# Altium schematic sheet 20-Power-P1V8.SchDoc
size B; SheetNumber: 20; SheetTotal: 22; SPICEModelCachePRDMSQGY: <root> / <DocumentId>PRDMSQGY</DocumentId> / <CacheFrame Number="0"> / <Model Name="emk105bj105_v-f" Kind="CKT"> / <Text>* EMK105BJ105_V-F     SPICE MODEL  ( General Type ) / *-------------------------------------------------------------------------------------------------------- / * Model Generated by TAIYO YUDEN Corporation (http://www.ty-top.com) / * Version 1.0 / * TAIYO YUDEN Control No. 170508_130520 / * Copyright(c) 2012 TAIYO YUDEN CO.,LTD. All Rights Reserved. / *-------------------------------------------------------------------------------------------------------- / * / * Products Name : Multilayer Ceramic Capacitors / * / * Characteristics : / *     Capacitance : 1 uF , Rated Voltage : 16V , TCC : X5R / *     Case Size : 1.0 x 0.5 / 0.039 x 0.02 [mm/inch] , Thickness : 0.5 / 0.02 [mm/inch] / *     (Conditions: Temperature = 25 degC , DC Bias Current/Voltage = 0A / 0V) / * / * Frequency Range : 40Hz - 3GHz / * / * External Node Assignments : / * / *  1  o---| |---o  2 / * / *-------------------------------------------------------------------------------------------------------- / .SubCkt EMK105BJ105_V-F 1 2 / **************************** / C0 1 110 0.68309u / Cm 1 101 0.26053u / C1 101 102 0.94076u / Rc1 101 102 1.9029k / C2 102 103 0.66707u / Rc2 102 103 120.36 / C3 103 110 0.57203u / Rc3 103 110 2.1097 / C2m 1 301 0.1871u / C21 301 302 3.2494u / Rc21 301 302 1.1117k / C22 302 303 2.1014u / Rc22 302 303 1.484k / C23 303 304 2.1172u / Rc23 303 304 1.3876k / C24 304 305 0.75729u / Rc24 304 305 332.59 / C25 305 306 0.94401u / Rc25 305 306 249.09 / C26 306 307 0.34674u / Rc26 306 307 28.352 / C27 307 308 0.37158u / Rc27 307 308 19.989 / C28 308 309 0.17933u / Rc28 308 309 31.748 / C29 309 110 0.016445u / Rc29 309 110 1.0592 / Rp0 1 110 100Meg / L0 110 120 0.2216n / Lm 120 130 0.1509n / L1 120 121 0.12659n / RL1 121 130 0.85161 / L2 120 122 0.15996n / RL2 122 130 0.42469 / L3 120 123 7.9543n / RL3 123 130 0.54643m / CR 120 124 0.24334u / LR 124 125 0.090738n / RR 125 130 68.076m / CL 130 140 2.7354p / LL 130 140 0.10762n / RL 130 140 50.614 / Rs 140 2 7.5416m / **************************** / .ends EMK105BJ105_V-F</Text> / </Model> / </CacheFrame> / </root>
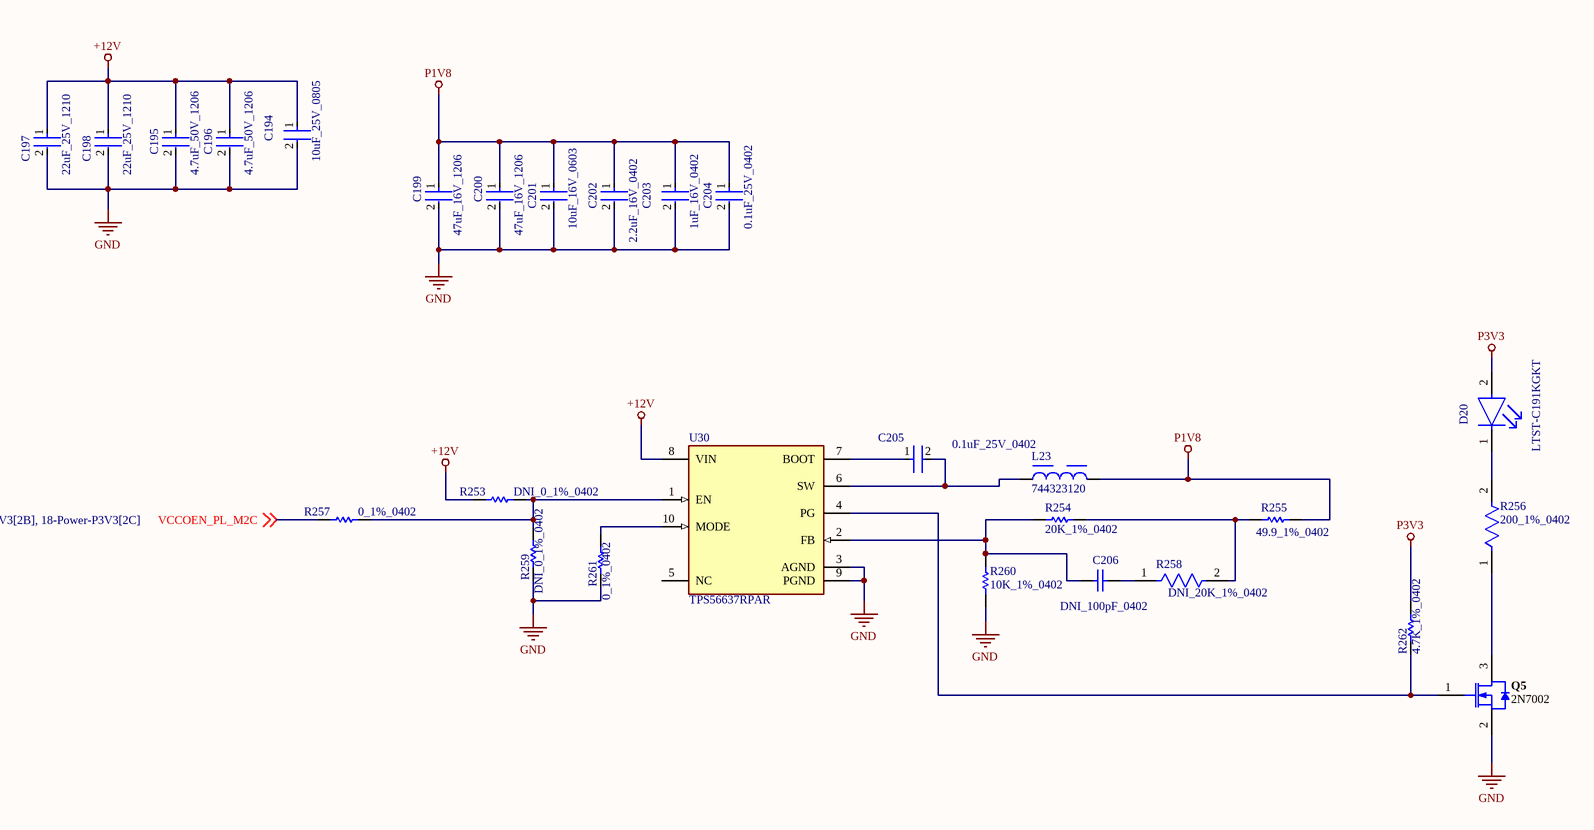
[diagram p0: 20-Power-P1V8.SchDoc]

## Parts
C194  10uF_25V_0805  [FP-0805-L_2_0_0_2-W_1_25-MFG]
C195  4.7uF_50V_1206  [FP-GRM31C-0_2-e0_3_0_8-IPC_C]
C196  4.7uF_50V_1206  [FP-GRM31C-0_2-e0_3_0_8-IPC_C]
C197  22uF_25V_1210  [FP-MK325M-MFG]
C198  22uF_25V_1210  [FP-MK325M-MFG]
C199  47uF_16V_1206  [FP-C3216-160-0_2-MFG]
C200  47uF_16V_1206  [FP-C3216-160-0_2-MFG]
C201  10uF_16V_0603  [FP-0603-L_1_6_0_2-W_0_8_0-MFG]
C202  2.2uF_16V_0402  [FP-C1005-050-0_05-IPC_A]
C203  1uF_16V_0402  [FP-0402-L_1_0_0_05-W_0_5-IPC_A]
C204  0.1uF_25V_0402  [FP-0402-L_1_0_1-W_0_5_0_1-IPC_C]
C205  0.1uF_25V_0402  [FP-0402-L_1_0_1-W_0_5_0_1-IPC_C]
C206  DNI_100pF_0402  [CAPC1005X55X25ML05T10]  (no BOM)
D20  LTST-C191KGKT  [FP-LTST-C191KGKT-MFG]
L23  744323120  [WE-HCI_1030]
Q5  2N7002  [INF-PG-SOT23_M]
R253  DNI_0_1%_0402  [RESC1005X40X25LL05T05]  (no BOM)
R254  20K_1%_0402  [RESC1005X40X25NL10T10]
R255  49.9_1%_0402  [RESC1005X40X25LL05T10]
R256  200_1%_0402  [FP-ERJ2RK-IPC_A]
R257  0_1%_0402  [RESC1005X40X25LL05T05]
R258  DNI_20K_1%_0402  [FP-ERJ2RK-MFG]  (no BOM)
R259  DNI_0_1%_0402  [RESC1005X40X25LL05T05]  (no BOM)
R260  10K_1%_0402  [RESC1005X40X25LL05T05]
R261  0_1%_0402  [RESC1005X40X25LL05T05]
R262  4.7K_1%_0402  [RESC1005X40X25NL10T10]
U30  TPS56637RPAR  [FP-RPA0010A-MFG]

## Nets
+12V: C194.1 C195.1 C196.1 C197.1 C198.1 R253.1 U30.8(VIN)
GND: C194.2 C195.2 C196.2 C197.2 C198.2 C199.2 C200.2 C201.2 C202.2 C203.2 C204.2 Q5.2(SOURCE) R259.1 R260.1 R261.1 U30.3(AGND) U30.9(PGND)
P1V8: C199.1 C200.1 C201.1 C202.1 C203.1 C204.1 L23.2 R255.2
P3V3: D20.2(A) R262.2
VCCOEN_PL_M2C: R257.1 ; off-sheet VCCOEN_PL_M2C
NetC205_1: C205.1 U30.7(BOOT)
NetC205_2: C205.2 L23.1 U30.6(SW)
NetC206_1: C206.1 R254.1 R260.2 U30.2(FB)
NetC206_2: C206.2 R258.1
NetD20_1: D20.1(C) R256.2
NetQ5_1: Q5.1(GATE) R262.1 U30.4(PG)
NetQ5_3: Q5.3(DRAIN) R256.1
NetR253_2: R253.2 R257.2 R259.2 U30.1(EN)
NetR254_2: R254.2 R255.1 R258.2
NetR261_2: R261.2 U30.10(MODE)

Not connected (* = marked no-connect by the designer): U30 5(NC)

## Library data of the parts
C194 = CMP-14477-000079-3: Multilayer Ceramic Capacitor 10uF 25V X5R 10% SMD 0805 T/R; Voltage: 16V; Dielectric: X7R; Number of Pins: 2; Width: 0.049inch; REACH SVHC: No SVHC; Packaging: Tape and Reel; Max Operating Temperature: 85°C; Length: 0.079inch; Termination: SMD/SMT; RoHS Compliant: Yes; Thickness: 0.053inch; Case/Package: 0805; Case Code (Imperial): 0805; Capacitance: 10uF; Lead Free: Lead Free; Voltage Rating: 25V; Resistor Type: Ceramic; Voltage Rating (DC): 25V; Case Code (Metric): 2012; Mount: Surface Mount; Package Quantity: 1; Height: 1.25mm; Series: M; Tolerance: 10%; Min Operating Temperature: -55°C
C195 C196 = CMP-1037-04923-3: Chip Multilayer Ceramic Capacitors for General Purpose, 1206, 4.7uF, X7R, 15%, 10%, 50V; Height: 1.6mm; Voltage: 50V; Capacitance: 4.7uF; Lead Free: Lead Free; Max Operating Temperature: 125°C; Packaging: Tape and Reel; REACH SVHC: No SVHC; Voltage Rating: 50V; Mount: Surface Mount; Termination: SMD/SMT; Tolerance: 10%; Case/Package: 1206; Material: Ceramic; Depth: 1.6mm; Length: 3.2mm; Case Code (Metric): 3216; Voltage Rating (DC): 50V; Case Code (Imperial): 1206; Radiation Hardening: No; Width: 0.063inch; Thickness: 0.071inch; Package Quantity: 2000; Min Operating Temperature: -55°C; Dielectric: X7R
C197 C198 = CMP-14477-000145-1: CAP CER 22UF 25V X5R 1210; Tolerance: 20%; Width: 0.098inch; Thickness: 0.106inch; Depth: 2.5mm; Packaging: Tape and Reel; Max Operating Temperature: 85°C; Termination: SMD/SMT; Case Code (Imperial): 1210; Height: 2.5mm; Case/Package: 1210; Voltage Rating: 25V; Package Quantity: 1; Min Operating Temperature: -55°C; Capacitance: 22uF; Halogen Free: Halogen Free; Case Code (Metric): 3225; Mount: Surface Mount; Construction: Flat; Radiation Hardening: No; Length: 3.2mm; Voltage Rating (DC): 25V; Contact Plating: Nickel; Number of Pins: 2; Dielectric: X5R; RoHS Compliant: Yes; Resistor Type: Ceramic; Series: M
C199 C200 = CMP-2000-07442-2: Multilayer Ceramic Capacitors 47uF ±20% 16V X5R SMD 1206; Resistor Type: Ceramic; Width: 0.063inch; Case Code (Imperial): 1206; Radiation Hardening: No; Thickness: 0.071inch; Dielectric: X5R; Weight: 0.000571oz; Termination: SMD/SMT; Dielectric Material: Ceramic; Min Operating Temperature: -55°C; Depth: 1.6mm; Case Code (Metric): 3216; Max Operating Temperature: 85°C; RoHS Compliant: Yes; REACH SVHC: No SVHC; Mount: Surface Mount; Lead Free: Lead Free; Height: 1.6mm; Length: 3.2mm; Tolerance: 20%; Voltage Rating (DC): 16V; Capacitance: 47uF; Package Quantity: 1; Construction: Flat; Packaging: Tape and Reel; Series: C; Case/Package: 1206; Voltage Rating: 16V
C201 = CMP-2000-06226-4: Multilayer Ceramic Capacitor 10uF 16V X5R 20% SMD 0603 T/R; Packaging: Tape and Reel; Construction: Flat; Height: 0.8mm; Max Operating Temperature: 85°C; Dielectric: X5R; Case Code (Metric): 1608; Voltage Rating (DC): 16V; Width: 0.031inch; Voltage Rating: 16V; Length: 0.063inch; RoHS Compliant: Yes; Halogen Free: Halogen Free; Case Code (Imperial): 0603; Capacitance: 10uF; Mount: Surface Mount; Thickness: 0.031inch; Tolerance: 20%; Min Operating Temperature: -55°C; Series: M; Termination: SMD/SMT; Case/Package: 0603; Package Quantity: 1
C202 = CMP-2000-05998-2: Multilayer Ceramic Capacitors 2.2μF ±10% 16V X5R SMD 0402; Capacitance: 2.2uF; REACH SVHC: No SVHC; Series: C; Termination: SMD/SMT; Case Code (Imperial): 0402; Depth: 0.5mm; Mount: Surface Mount; Width: 0.02inch; Package Quantity: 1; Dielectric Material: Ceramic; Length: 1mm; Packaging: Tape and Reel; Case Code (Metric): 1005; RoHS Compliant: Yes; Dielectric: X5R; Max Operating Temperature: 85°C; Lead Free: Lead Free; Weight: 2.3E-05oz; Thickness: 0.022inch; Voltage Rating (DC): 16V; Tolerance: 10%; Voltage Rating: 16V; Resistor Type: Ceramic; Height: 0.5mm; Case/Package: 0402; Min Operating Temperature: -55°C
C203 = CMP-14477-000104-2: None; Tolerance: 10%; Voltage Rating: 16V; Dielectric: X5R; Capacitance: 1uF; Packaging: Tape and Reel; Depth: 0.5mm; Mount: Surface Mount; Thickness: 0.022inch; Package Quantity: 1; Min Operating Temperature: -55°C; Series: M; Voltage Rating (DC): 16V; Termination: SMD/SMT; Case/Package: 0402; Number of Pins: 2; Case Code (Imperial): 0402; Length: 1mm; Halogen Free: Halogen Free; Case Code (Metric): 1005; Width: 0.02inch; RoHS Compliant: Yes; Radiation Hardening: No; Max Operating Temperature: 85°C; Height: 0.5mm; Construction: Flat
C204 C205 = CMP-2008-02519-2: General Purpose Ceramic Capacitor, 0402, 100nF, 10%, X7R, 15%, 25V; Package Quantity: 1; Capacitance: 100nF; Min Operating Temperature: -55°C; Voltage: 25V; Voltage Rating: 25V; Construction: Flat; Max Operating Temperature: 125°C; Radiation Hardening: No; Depth: 0.5mm; Thickness: 0.022inch; Voltage Rating (DC): 25V; Number of Pins: 2; Lead Free: Lead Free; Series: -; REACH SVHC: No SVHC; Length: 1mm; Dielectric: X7R; RoHS Compliant: Yes; Mount: Surface Mount; Packaging: Tape and Reel; Case/Package: 0402; Case Code (Imperial): 0402; Termination: SMD/SMT; Width: 0.02inch; Case Code (Metric): 1005; Tolerance: 10%
C206 = CMP-2008-03915-1: Manufacturer: Murata; Part Number: GRM1555C1H101JA01D
D20 = CMP-2000-05198-2: LED GREEN CLEAR SMD; Max Power Dissipation: 75mW; Forward Current: 30mA; Reverse Voltage: 5V; Lens Color: Colorless; Forward Voltage: 2V; Dominant Wavelength: 571nm; Number of LEDs: 1; Viewing Angle: 130°; Lens Style: Rectangular; Test Current: 20mA; Luminous Intensity: 35mcd; Wavelength: 574nm; Width: 0.8mm; Case Code (Imperial): 0603; Number of Pins: 2; Lead Free: Lead Free; Packaging: Tape and Reel; Package Quantity: 1; Min Operating Temperature: -55°C; Case/Package: 0603; Length: 1.6mm; Power Dissipation: 75mW; Depth: 0.8mm; Radiation Hardening: No; Mount: Surface Mount; Max Operating Temperature: 85°C; Color: Green; Power Rating: 75mW; Height: 0.55mm; Illumination Color: Green; Case Code (Metric): 1608; Lens Transparency: Clear; Number of Elements: 1
L23 = CMP-0226-00168-2: NexarPartId: 23379116; Self Resonant Frequency: 59MHz; Max DC Current: 12A; DC Resistance (DCR): 6.6mΩ; Shielding: Shielded; Saturation Current: 15A; Inductance Tolerance: 20%; Inductance: 1.2µH; Series Resistance: 6.6Ω; Test Frequency: 100kHz; Termination: SMD/SMT; Length: 10.6mm; REACH SVHC: No SVHC; Case/Package: Nonstandard; Width: 10.6mm; Min Operating Temperature: -40°C; Composition: Wirewound; Ambient Temperature Range Low: -40°C; Number of Pins: 2; Current Rating: 12A; Depth: 10.6mm; Height - Seated (Max): 3.0988mm; Max Operating Temperature: 150°C; Ambient Temperature Range High: 100°C; Packaging: Tape & Reel (TR); Mount: Surface Mount; Height: 2.8mm; Tolerance: 20%; RoHS: Compliant
Q5 = CMP-1149-00026-1: N-Channel OptiMOS Small-Signal-Transistor, 60 V VDS, 0.3 A ID, -55 to 150 degC, PG-SOT23, Reel, Green; Manufacturer: Infineon; RDS (on) (max) (@4.5V): 4,000 mOhm; VDS (max): 60 V; IDpuls (max): 1.2Â A; QG: 0.4Â nC; RDS (on) (max): 3,000 mOhm; RthJA (max): 250 K/W; ID (max): 0.3Â A; VGS(th) (max): 2.5Â V; VGS(th) (min): 1.5Â V; Green: TRUE; Ptot (max): 0.5Â W; PackageDescription: 3-Pin Small Outline Transistor Package, 2.9 x 1.3 mm Body, 0.95 mm Pitch; Halogen-free: TRUE; ComponentLink2Description: Datasheet; ComponentLink1URL: http://www.infineon.com/; Packing: Reel; DatasheetVersion: Rev. 2.4; PartNumber: 2N7002; PackageReference: PG-SOT23; PackageVersion: Apr-08; ComponentLink3URL: http://www.infineon.com/dgdl/SOT23-Package_Overview.pdf?folderId=db3a30431936bc4b0119532290053c66&fileId=db3a30431936bc4b0119533468123c85; ComponentLink1Description: Manufacturer URL; Mounting Technology: Surface Mount; ComponentLink3Description: Package Specification; ComponentLink2URL: http://www.infineon.com/dgdl/2N7002_Rev2.4.pdf?folderId=db3a3043156fd573011622e10b5c1f67&fileId=db3a304319bc939a0119c2a9461e79e6
R253 R257 R259 R261 = CMP-2000-07451-1: Chip Resistor, 0 Ohm, 0.1 W, -55 to 155 degC, 0402 (1005 Metric), RoHS, Tape and Reel; Manufacturer: Panasonic; Voltage Rating (DC): 50V; Temperature Coefficient: 600ppm/��C; Max Power Dissipation: 100mW; Resistance: 0mOhm; Tolerance: 5%; Number of Terminations: 2; Mount: SurfaceMount; Height: 0.35mm; Packaging: TapeandReel; Contact Plating: Tin; Manufacturer URL: http://www.panasonic.com/; Composition: ThickFilm; Max Operating Temperature: 155degC; REACH SVHC: NoSVHC; Case/Package: 0402; Package Reference: 402; Depth: 0.5mm; Package Description: 2-Pin Surface Mount Device, Body 1 x 0.5 mm; Datasheet URL: https://industrial.panasonic.com/cdbs/www-data/pdf/RDA0000/AOA0000C301.pdf; RoHSCompliant: True; Case Code (Imperial): 0402; Military Standard: Not; Min Operating Temperature: -55degC; Power Rating: 100mW; Datasheet Version: 03/2015; Length: 1mm; Case Code (Metric): 1005; Termination: SMD/SMT; Mounting Technology: SurfaceMount; Voltage Rating: 50V; Width: 0.02inch; Package Quantity: 1; Lead Free: LeadFree; Radiation Hardening: No
R254 = CMP-2002-06039-1: Part Number: MC00625W0402120K; Manufacturer: Multicomp
R255 = CMP-2002-07709-1: Manufacturer: Yageo / Phycomp; Part Number: RC0402FR-0749R9L
R256 = CMP-2002-00757-2: RES SMD 200 OHM 1% 1/10W 0402; Power Rating: 100mW; Voltage Rating (DC): 50V; Resistance: 200R; Temperature Coefficient: 100ppm/°C; RoHS Compliant: Yes; Packaging: Tape and Reel; Case Code (Metric): 1005; Package Quantity: 1; Contact Plating: Tin; Series: ERJ; Mount: Surface Mount; Lead Free: Lead Free; Min Operating Temperature: -55°C; Number of Terminations: 2; Max Power Dissipation: 100mW; Technology: THICK FILM; Voltage Rating: 50V; Case/Package: 0402; Width: 0.02inch; Termination: SMD/SMT; Military Standard: Not; Height: 0.35mm; Radiation Hardening: No; Resistance Tolerance: 1%; Length: 1mm; REACH SVHC: No SVHC; Construction: Rectangular; Depth: 0.5mm; Features: Automotive AEC-Q200; Resistor Type: Thick Film; Case Code (Imperial): 0402; Tolerance: 1%; Size Code: 0402; Max Operating Temperature: 155°C
R258 = CMP-2002-00759-4: RES SMD 20K OHM 1% 1/10W 0402; Resistance: 20kR; Voltage Rating (DC): 50V; Power Rating: 100mW; Temperature Coefficient: 100ppm/°C; Radiation Hardening: No; Case/Package: 0402; Case Code (Metric): 1005; Min Operating Temperature: -55°C; Termination: SMD/SMT; Package Quantity: 1; Length: 1mm; Case Code (Imperial): 0402; Lead Free: Lead Free; Height: 0.35mm; Max Operating Temperature: 155°C; Depth: 0.5mm; Number of Terminations: 2; Military Standard: Not; Max Power Dissipation: 100mW; Tolerance: 1%; Composition: Thick Film; Weight: 2.8E-05oz; Features: Automotive AEC-Q200; Voltage Rating: 50V; Contact Plating: Tin; REACH SVHC: No SVHC; Width: 0.02inch; Packaging: Cut Tape; Mount: Surface Mount
R260 = CMP-2000-07588-1: Chip Resistor, 10 KOhm, +/- 1%, 0.1 W, -55 to 155 degC, 0402 (1005 Metric), RoHS, Tape and Reel; Manufacturer: Panasonic; Power Rating: 100mW; Voltage Rating: 50V; Resistance: 10KOhm; Case\/Package: 0402; Temperature Coefficient: 100ppm\/degreesC; RoHSCompliant: True; Lead Free: LeadFree; Package Quantity: 1; Contact Plating: Tin; Length: 1mm; Radiation Hardening: No; REACH SVHC: NoSVHC; Max Operating Temperature: 155degC; Depth: 0.5mm; Case Code (Imperial): 0402; Military Standard: Not; Package Description: 2-Pin Surface Mount Device, Body 1 x 0.5 mm; Termination: SMD/SMT; Case Code (Metric): 1005; Height: 0.35mm; Packaging: TapeandReel; Voltage Rating (DC): 50V; Package Reference: 402; Number of Pins: 2; Tolerance: 1%; Mounting Technology: SurfaceMount; Width: 0.02inch; Mount: SurfaceMount; Datasheet URL: https://industrial.panasonic.com/cdbs/www-data/pdf/RDA0000/AOA0000C304.pdf; Composition: ThickFilm; Datasheet Version: 02/2017; Manufacturer URL: http://www.panasonic.com/; Max Power Dissipation: 100mW; Number of Terminations: 2; Min Operating Temperature: -55degC
R262 = CMP-2002-05217-1: Manufacturer: Bourns; Part Number: CR0402-FX-4701GLF
U30 = CMP-04918-000008-1: IC POWER MANAGEMENT; Manufacturer: Texas Instruments; Max Duty Cycle: 91%; Nominal Supply Current: 140uA; Max Supply Voltage: 28V; Output Current: 6A; Switching Frequency: 500kHz; Output Type: AdjustableProgrammable; Max Junction Temp: +150°C; Output Voltage: 0.6-13V; Switching Topology: Buck; Standoff Height: 0mm; Number Of Outputs: 1; Min Supply Voltage: 4.5V; Automotive: No; Manufacturer Part Number: TPS56637RPAR; Lead Free: Yes; Temperature Range Low: -40°C; Digikey Description: IC POWER MANAGEMENT; Octopart: https://octopart.com/tps56637rpar-texas+instruments-97650653; Temperature: -40°C to +150°C; Device Class L3: Voltage Regulators - Switching; Temperature Range High: +150°C; Package: RPA0010A; Device Class L2: Power Management ICs; ComponentLink2URL: http://www.ti.com/lit/ds/symlink/tps56637.pdf; Device Class L1: Integrated Circuits (ICs); RoHS: TRUE; ComponentLink2Description: Datasheet; Height: 1mm; Category: IC